# Altium schematic sheet Top Level.SchDoc
size A4
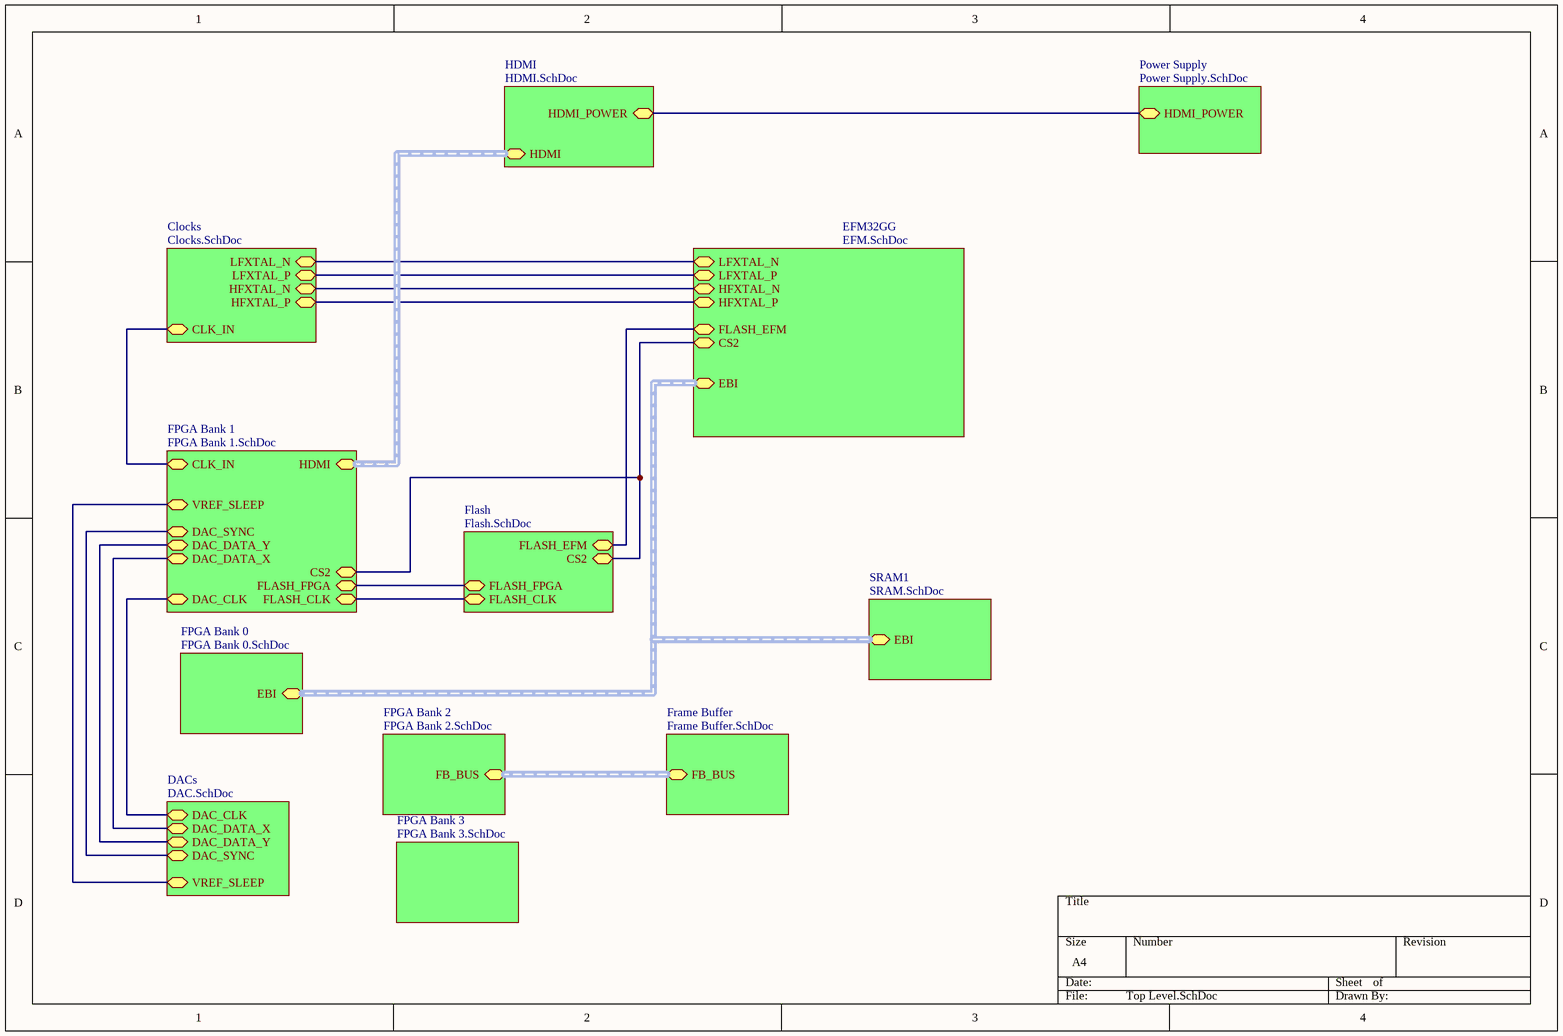
[diagram p0: Top Level.SchDoc]

## Sub-sheets
Clocks = Clocks.SchDoc: LFXTAL_N, LFXTAL_P, HFXTAL_N, HFXTAL_P, CLK_IN
DACs = DAC.SchDoc: DAC_CLK, DAC_DATA_X, DAC_DATA_Y, VREF_SLEEP, DAC_SYNC
EFM32GG = EFM.SchDoc: EBI (harness EFM_HARNESS), LFXTAL_N, LFXTAL_P, HFXTAL_N, HFXTAL_P, FLASH_EFM, CS2
Flash = Flash.SchDoc: FLASH_CLK, FLASH_FPGA, FLASH_EFM, CS2
FPGA Bank 0 = FPGA Bank 0.SchDoc: EBI (harness FPGAA_HARNESS)
FPGA Bank 1 = FPGA Bank 1.SchDoc: CLK_IN, DAC_CLK, FLASH_CLK, FLASH_FPGA, CS2, DAC_DATA_X, DAC_DATA_Y, VREF_SLEEP, DAC_SYNC, HDMI
FPGA Bank 2 = FPGA Bank 2.SchDoc: FB_BUS (harness SRAM2_HARNESS)
FPGA Bank 3 = FPGA Bank 3.SchDoc: no entries
Frame Buffer = Frame Buffer.SchDoc: FB_BUS (harness FB_HARNESS)
HDMI = HDMI.SchDoc: HDMI, HDMI_POWER
Power Supply = Power Supply.SchDoc: HDMI_POWER
SRAM1 = SRAM.SchDoc: EBI (harness SRAM1_HARNESS)

## Nets
(unnamed): sheet FPGA Bank 1/CLK_IN, sheet Clocks/CLK_IN
(unnamed): sheet FPGA Bank 1/DAC_CLK, sheet DACs/DAC_CLK
(unnamed): sheet FPGA Bank 1/FLASH_CLK, sheet Flash/FLASH_CLK
(unnamed): sheet FPGA Bank 1/FLASH_FPGA, sheet Flash/FLASH_FPGA
(unnamed): sheet FPGA Bank 1/CS2, sheet EFM32GG/CS2, sheet Flash/CS2
(unnamed): sheet FPGA Bank 1/DAC_DATA_X, sheet DACs/DAC_DATA_X
(unnamed): sheet FPGA Bank 1/DAC_DATA_Y, sheet DACs/DAC_DATA_Y
(unnamed): sheet FPGA Bank 1/VREF_SLEEP, sheet DACs/VREF_SLEEP
(unnamed): sheet FPGA Bank 1/DAC_SYNC, sheet DACs/DAC_SYNC
(unnamed): sheet EFM32GG/LFXTAL_N, sheet Clocks/LFXTAL_N
(unnamed): sheet EFM32GG/LFXTAL_P, sheet Clocks/LFXTAL_P
(unnamed): sheet EFM32GG/HFXTAL_N, sheet Clocks/HFXTAL_N
(unnamed): sheet EFM32GG/HFXTAL_P, sheet Clocks/HFXTAL_P
(unnamed): sheet EFM32GG/FLASH_EFM, sheet Flash/FLASH_EFM
(unnamed): sheet HDMI/HDMI_POWER, sheet Power Supply/HDMI_POWER

## Buses and harness runs
harness sheet EFM32GG/EBI = sheet FPGA Bank 0/EBI = sheet SRAM1/EBI
harness sheet FPGA Bank 1/HDMI = sheet HDMI/HDMI
harness sheet FPGA Bank 2/FB_BUS = sheet Frame Buffer/FB_BUS